# EAGLE schematic fisk-batt (EAGLE 7.6.0)
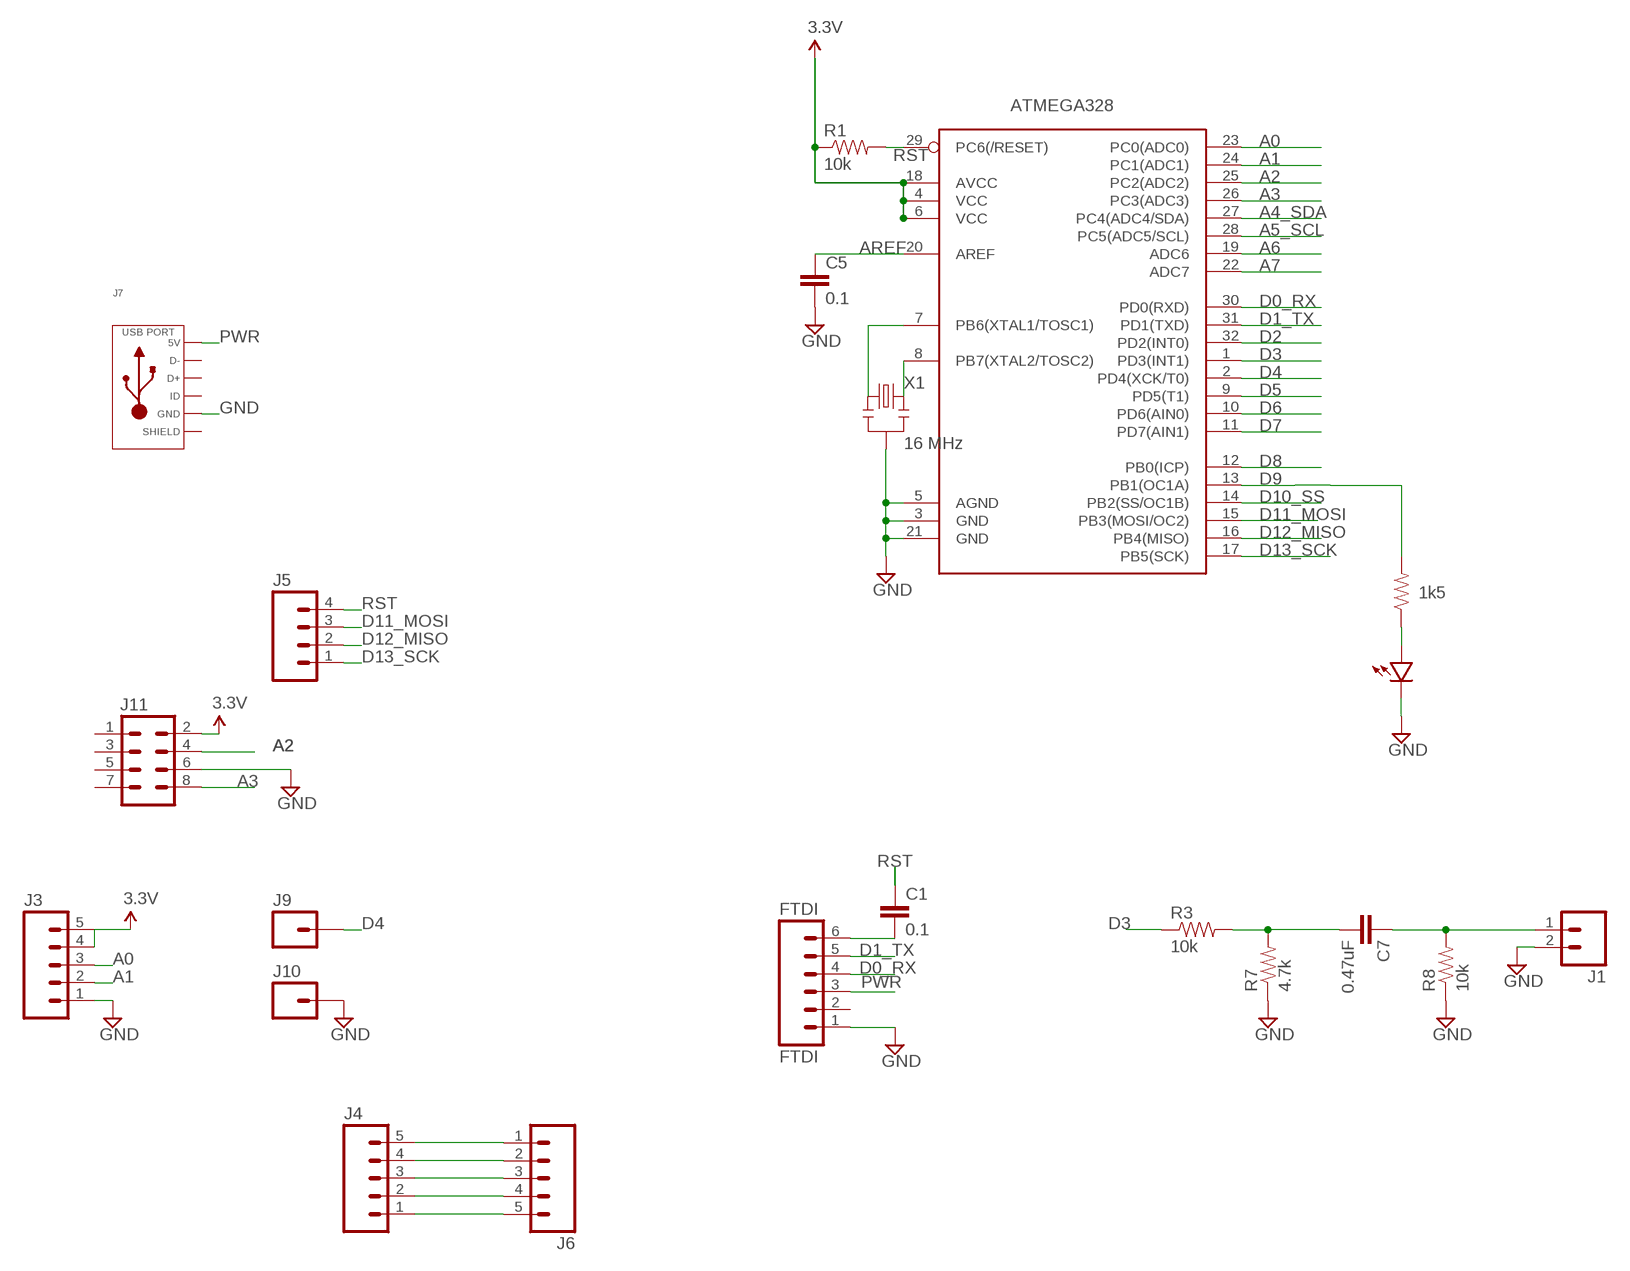
[diagram p0: schematic, sheet 1, part 1 of 2]
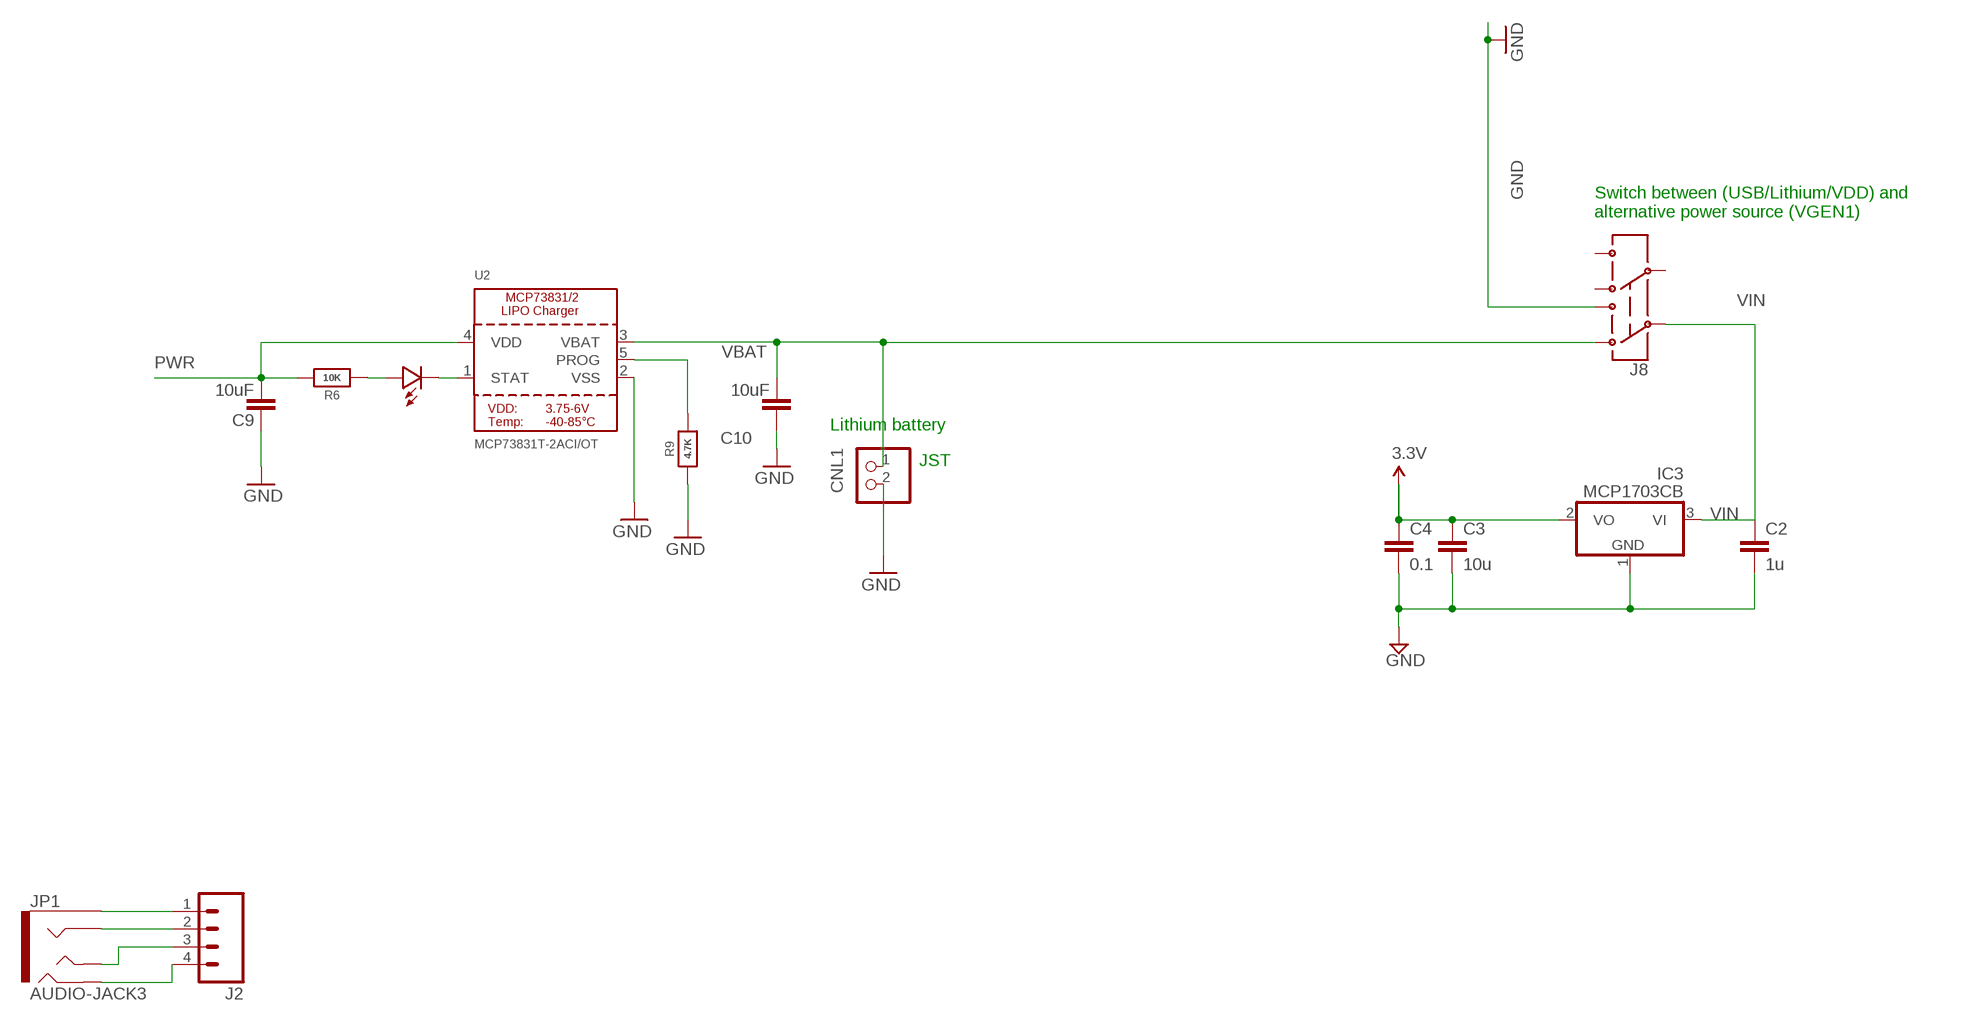
[diagram p1: schematic, sheet 1, part 2 of 2]

## Parts
ATMEGA328  ATMega-328  ATMEGA168/328TQFP32  [TQFP32-08]
C1  0.1  CAP0603-CAP  [0603-CAP]
C2  1u  CAP0603-CAP  [0603-CAP]
C3  10u  CAP0805-CAP  [0805-CAP]
C4  0.1  CAP0603-CAP  [0603-CAP]
C5  0.1  CAP0603-CAP  [0603-CAP]
C7  0.47uF  CAP0603-CAP  [0603-CAP]
C9  10uF  CAP0603-CAP  [0603-CAP]
C10  10uF  CAP0603-CAP  [0603-CAP]
CNL1  JST_2PIN-SMT-RA  [JST-PH-2-SMT-RA]
D2  LED0603  [0603-LED]
FTDI  FTDI  M06SIP  [1X06]
IC3  MCP1703CB  [SOT23]
J1  M02PTH  [1X02]
J2  M04PTH  [1X04]
J3  M05PTH  [1X05]
J4  M05PTH  [1X05]
J5  M04PTH  [1X04]
J6  M05SCREW  [SCREWTERMINAL-3.5MM-5]
J7  USB_MICRO_RIGHT  [MICROUSB-RIGHT]
J8  AYZ0202  [AYZ0202]
J9  M01PTH  [1X01]
J10  M01PTH  [1X01]
J11  M04X2  [2X4]
JP1  AUDIO-JACK3  [AUDIO-JACK-TRRS-SMD]
R1  10k  RESISTOR0603-RES  [0603-RES]
R2  1k5  RESISTOR0603-RES  [0603-RES]
R3  10k  RESISTOR0603-RES  [0603-RES]
R6  10K  RESISTOR_0603_NOOUT  [0603-NO]
R7  4.7k  RESISTOR0603-RES  [0603-RES]
R8  10k  RESISTOR0603-RES  [0603-RES]
R9  4.7K  RESISTOR_0603_NOOUT  [0603-NO]
U2  MCP73831T-2ACI/OT  MCP73831/2  [SOT23-5]
U$2  LED0603  [0603-LED]
X1  16 MHz  RESONATORSMD  [RESONATOR-SMD]

## Nets
A0: ATMEGA328.23(PC0(ADC0)) J3.3
A1: ATMEGA328.24(PC1(ADC1)) J3.2
A2: ATMEGA328.25(PC2(ADC2)) J11.4
A3: ATMEGA328.26(PC3(ADC3)) J11.8
A4_SDA: ATMEGA328.27(PC4(ADC4/SDA))
A5_SCL: ATMEGA328.28(PC5(ADC5/SCL))
A6: ATMEGA328.19(ADC6)
A7: ATMEGA328.22(ADC7)
AREF: ATMEGA328.20(AREF) C5.1
D0_RX: ATMEGA328.30(PD0(RXD)) FTDI.4
D1_TX: ATMEGA328.31(PD1(TXD)) FTDI.5
D2: ATMEGA328.32(PD2(INT0))
D3: ATMEGA328.1(PD3(INT1)) R3.1
D4: ATMEGA328.2(PD4(XCK/T0)) J9.1
D5: ATMEGA328.9(PD5(T1))
D6: ATMEGA328.10(PD6(AIN0))
D7: ATMEGA328.11(PD7(AIN1))
D8: ATMEGA328.12(PB0(ICP))
D9: ATMEGA328.13(PB1(OC1A)) R2.2
D10_SS: ATMEGA328.14(PB2(SS/OC1B))
D11_MOSI: ATMEGA328.15(PB3(MOSI/OC2)) J5.3
D12_MISO: ATMEGA328.16(PB4(MISO)) J5.2
D13_SCK: ATMEGA328.17(PB5(SCK)) J5.1
GND [power]: ATMEGA328.3(GND) ATMEGA328.5(AGND) ATMEGA328.21(GND) C2.2 C3.2 C4.2 C5.2 C9.2 C10.2 CNL1.2 FTDI.1 IC3.1(GND) J1.2 J3.1 J7.5(GND) J8.1 J10.1 J11.6 R7.1 R8.1 R9.1 U2.2(VSS) U$2.MINUS X1.2
N$1: ATMEGA328.7(PB6(XTAL1/TOSC1)) X1.1
N$2: R2.1 U$2.PLUS
N$3: C7.2 R3.2 R7.2
N$4: C7.1 J1.1 R8.2
N$5: J2.1 JP1.EARTH
N$6: J2.2 JP1.RING1
N$7: J2.3 JP1.TIP
N$8: J2.4 JP1.RING2
N$9: J4.5 J6.1
N$10: J4.4 J6.2
N$11: J4.3 J6.3
N$12: J4.2 J6.4
N$13: J4.1 J6.5
N$16: R9.2 U2.5(PROG)
N$17: D2.MINUS U2.1(STAT)
N$18: D2.PLUS R6.1
N$20: C1.2 FTDI.6
N$21: ATMEGA328.8(PB7(XTAL2/TOSC2)) X1.3
PWR [power]: C9.1 FTDI.3 J7.1(5V) R6.2 U2.4(VDD)
RST: ATMEGA328.29(PC6(/RESET)) C1.1 J5.4 R1.2
VBAT [power]: C10.1 CNL1.1 J8.3 U2.3(VBAT)
VCC: ATMEGA328.4(VCC) ATMEGA328.6(VCC) ATMEGA328.18(AVCC) C3.1 C4.1 IC3.2(VO) J3.4 J3.5 J11.2 R1.1 ; supply symbol labelled 3.3V
VIN: C2.1 IC3.3(VI) J8.2
Unconnected: FTDI.2 J7.2(D-) J7.3(D+) J7.4(ID) J8.4 J8.5 J8.6 J11.1 J11.3 J11.5 J11.7

## Notes on the sheet
- Switch between (USB/Lithium/VDD) and 
  alternative power source (VGEN1)
- Lithium battery
- JST

## Power pins joined to a net without a drawn wire
SLD: J7.S1(SLD) J7.S2(SLD) J7.S3(SLD) J7.S4(SLD) J7.S5(SLD) J7.S6(SLD) J7.S7(SLD) J7.S8(SLD)

## Library data of the parts
ATMEGA328 = LowPowerLab:ATMEGA168/328: Atmel 32-pin 8-bit micro, 16k flash.
C1-C5 C7 = LowPowerLab:CAP: Capacitor Standard 0603 ceramic capacitor, and 0.1" leaded capacitor.
C9 C10 = SparkFun:CAP: Capacitor Standard 0603 ceramic capacitor, and 0.1" leaded capacitor.
CNL1 = adafruit:JST_2PIN: JST 2-Pin Connectors of various flavors SMT-RA (S2B-PH-SM4) 4UConnector #17311 SMT (B2B-PH-SM4) THM-RA (S2B-PH) THM (B2B-PH)
D2 U$2 = LowPowerLab:LED
FTDI = SparkFun-Connectors:M06: Header 6 Standard 6-pin 0.1" header. Use with straight break away headers (SKU : PRT-00116), right angle break away headers (PRT-00553), swiss pins (PRT-00743), machine pins (PRT-00117), and female headers (PRT-00115). Molex polarized connector foot print use with SKU : PRT-08094 with associated crimp pins and housings. NOTES ON THE VARIANTS LOCK and LOCK_LONGPADS... This footprint was designed to help hold the alignment of a through-hole component (i.e. 6-pin header) while soldering it into place. You may notice that each hole has been shifted either up or down by 0.005 of an inch from it's more standard position (which is a perfectly straight line). This slight alteration caused the pins (the squares in the middle) to touch the edges of the holes. Because they are alternating, it causes a "brace" to hold the component in place. 0.005 has proven to be the perfect amount of "off-center" position when using our standard breakaway headers. Although looks a little odd when you look at the bare footprint, once you have a header in there, the alteration is very hard to notice. Also, if you push a header all the way into place, it is covered up entirely on the bottom side. This idea of altering the position of holes to aid alignment will be further integrated into the Sparkfun Library for other footprints. It can help hold any component with 3 or more connection pins.
IC3 = linear:MCP1703: 250 mA, 16V, Low Quiescent Current LDO Regulator Source: http://ww1.microchip.com/downloads/en/DeviceDoc/22049b.pdf
J1 = SparkFun-Connectors:M02: Standard 2-pin 0.1" header. Use with - straight break away headers ( PRT-00116) - right angle break away headers (PRT-00553) - swiss pins (PRT-00743) - machine pins (PRT-00117) - female headers (PRT-00115) Molex polarized connector foot print use with: PRT-08233 with associated crimp pins and housings. 2.54_SCREWTERM for use with PRT-10571. 3.5mm Screw Terminal footprints for PRT-08084 5mm Screw Terminal footprints for use with PRT-08432
J2 J5 = SparkFun-Connectors:M04: Header 4 Standard 4-pin 0.1" header. Use with straight break away headers (SKU : PRT-00116), right angle break away headers (PRT-00553), swiss pins (PRT-00743), machine pins (PRT-00117), and female headers (PRT-00115). Molex polarized connector foot print use with SKU : PRT-08231 with associated crimp pins and housings. 1MM SMD Version SKU: PRT-10208; PROD_ID: CONN-09696
J3 J4 = SparkFun-Connectors:M05: Header 5 Standard 5-pin 0.1" header. Use with straight break away headers (SKU : PRT-00116), right angle break away headers (PRT-00553), swiss pins (PRT-00743), machine pins (PRT-00117), and female headers (PRT-00115). Molex polarized connector foot print use with SKU : PRT-08230 with associated crimp pins and housings.
J6 = SparkFun-Connectors:M05: Header 5 Standard 5-pin 0.1" header. Use with straight break away headers (SKU : PRT-00116), right angle break away headers (PRT-00553), swiss pins (PRT-00743), machine pins (PRT-00117), and female headers (PRT-00115). Molex polarized connector foot print use with SKU : PRT-08230 with associated crimp pins and housings.; PROD_ID: Combine 8288+8399
J7 = MF_Connectors:USB: Library: MF_Connectors Description: 5 Pin USB Connectors. SLD is the shield connection. Usually tied to ground through a small ferrite bead.
J8 = SparkFunNew:AYZ0202: SPDT Slide Switch Simple SMD single-pull double-throw slide switch. Good for less than 350mA power switch, switching UARTs between devices, etc. Spark Fun Electronics SKU : COM-00597
J9 J10 = SparkFun-Connectors:M01: Header 1 Standard 1-pin 0.1" header. Use with straight break away headers (SKU : PRT-00116), right angle break away headers (PRT-00553), swiss pins (PRT-00743), machine pins (PRT-00117), and female headers (PRT-00115). SMTSO-256-ET is a "flush mount" nut for a 4-40 screw. The older package used to be too tight, and did not allow it to sit properly thru the drill hit. The latest (0.165DIA) fits nice and snug.
J11 = SparkFun-Connectors:M04X2: .1" header, two rows of four.
JP1 = SparkFun-Connectors:AUDIO-JACK3: Audio jack - 3.5mm TRRS variety - two rings.
R1-R3 R7 R8 = LowPowerLab:RESISTOR: Resistor Basic schematic elements and footprints for 0603, 1206, and PTH resistors.
R6 R9 = microbuilder:RESISTOR: Resistors For new designs, use the packages preceded by an '_' character since they are more reliable: The following footprints should be used on most boards: _0402 - Standard footprint for regular board layouts _0603 - Standard footprint for regular board layouts _0805 - Standard footprint for regular board layouts _1206 - Standard footprint for regular board layouts For extremely tight-pitch boards where space is at a premium, the following 'micro-pitch' footprints can be used (smaller pads, no silkscreen outline, etc.): _0402MP - Micro-pitch footprint for very dense/compact boards _0603MP - Micro-pitch footprint for very dense/compact boards _0805MP - Micro-pitch footprint for very dense/compact boards _1206MP - Micro-pitch footprint for very dense/compact boards
U2 = microbuilder:MCP73831/2: MCP73831/2 LIPO Charger VDD: 3.75 - 6V Temp -40 - 85°C Programmable Charge Rate: 15-500mA NOTE: STAT is a tri-state logic output on the MCP73831 and an open-drain output on the MCP73832. SOT23-5 with 4.2V output and tri-state logic on STAT = MCP73831T-2ACI/OT
X1 = SparkFun:RESONATOR: Resonator Small SMD resonator. This is the itty bitty 10/20MHz resonators with built in caps. CSTCE10M0G55 and CSTCE20M0V53. Footprint has been reviewed closely but hasn't been tested yet.

## Net classes
1 power: width 0.305 mm